# Altium project B101AA.PrjPcb (part 1 of 2)
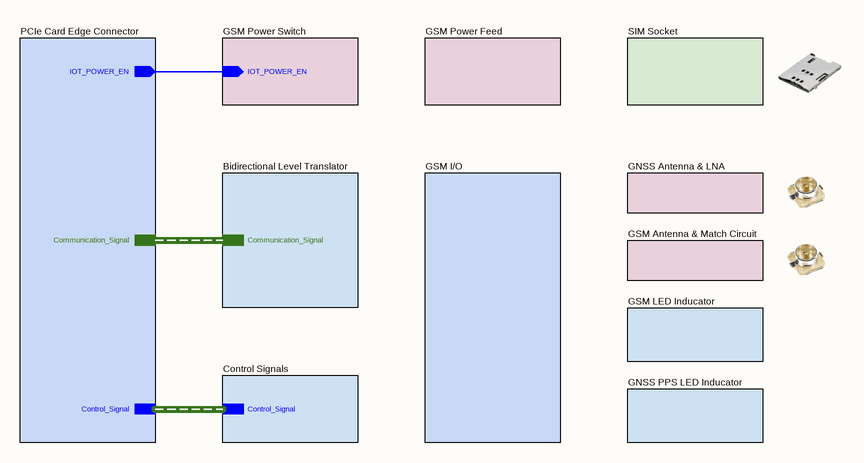
[diagram p0: GSM IoT Block Diagram.SchDoc]
Address1_: Buyuk Kayacik Mah. 4. OSB; Address2_: 103. Cad. No : 12; Address3_: Selcuklu / Konya; Address4_: Türkiye; Copyright_: Copyright 2022 STF Tarim (Commercial Secret); Customer_: STF Irrigation; Engineer_: Gunce Akkoyun; Git_Repo_Address_: www.github.com/akkoyun/B152AA; Module_ID_: B101AA; Organization_: STF Res-Dev; Product_Desc_: --; Product_ID_: --; Revision_: 00.00.01; Version_: R1
15 sheets, 93 parts. Net scope: hierarchical (ports join the sheet entries above them; power ports are global).
Board file: B101AA.PcbDoc
Sheets:
  GSM IoT Block Diagram.SchDoc
    Bidirectional Level Translator = Voltage Translator.SchDoc
    GSM Antenna & Match Circuit = GSM Antenna.SchDoc
    GSM LED Inducator = GSM Stat LED Driver.SchDoc
    SIM Socket = SIM Socket.SchDoc
    GNSS Antenna & LNA = GNSS Antenna.SchDoc
    GSM Power Switch = GSM Power Switch.SchDoc
    GSM I/O = GSM Un Used.SchDoc
    PCIe Card Edge Connector = Card Edge Connector.SchDoc
    GNSS PPS LED Inducator = GNSS PPS LED Driver.SchDoc
    GSM Power Feed = GSM Modem Power Feed.SchDoc
    Control Signals = Signal Control Block.SchDoc
      On-Off Control = On-Off Signal Control.SchDoc
      SDown Control = Shut Down Signal Control.SchDoc
      GNSS Enable Control = GNSS EN Signal Control.SchDoc

## Sheet GSM IoT Block Diagram.SchDoc: GSM IoT Block Diagram
size 292 x 193 mm; SheetNumber: 1; SheetTotal: 14

### Sub-sheets
Bidirectional Level Translator = Voltage Translator.SchDoc: Communication_Signal (harness Communication_Signal)
Control Signals = Signal Control Block.SchDoc: Control_Signal (harness Control_Signal)
GNSS Antenna & LNA = GNSS Antenna.SchDoc: no entries
GNSS PPS LED Inducator = GNSS PPS LED Driver.SchDoc: no entries
GSM Antenna & Match Circuit = GSM Antenna.SchDoc: no entries
GSM I/O = GSM Un Used.SchDoc: no entries
GSM LED Inducator = GSM Stat LED Driver.SchDoc: no entries
GSM Power Feed = GSM Modem Power Feed.SchDoc: no entries
GSM Power Switch = GSM Power Switch.SchDoc: IOT_POWER_EN (in)
PCIe Card Edge Connector = Card Edge Connector.SchDoc: IOT_POWER_EN (out), Control_Signal (harness Control_Signal), Communication_Signal (harness Communication_Signal)
SIM Socket = SIM Socket.SchDoc: no entries

### Nets
IOT_POWER_EN: sheet GSM Power Switch/IOT_POWER_EN, sheet PCIe Card Edge Connector/IOT_POWER_EN

### Buses and harness runs
harness sheet Bidirectional Level Translator/Communication_Signal = sheet PCIe Card Edge Connector/Communication_Signal
harness sheet Control Signals/Control_Signal = sheet PCIe Card Edge Connector/Control_Signal

### Notes on the sheet
- © 2021 All rights reserved.
  This document may not, in whole or in part, be copied, photocopied, reproduced, translated or converted to any electronic or machine readable from without prior written permission of Mehmet Günce Akkoyun.
  Engineer contact : akkoyun@me.com
- Property of
- Engineer :
- Date :
- Size :
- A4
- Time :
- Project :
- Page :
- /
- Customer :
- Product ID :
- Module ID :
- Version :
- File :
- Revision :

## Sheet Voltage Translator.SchDoc: Voltage Translator
size 393 x 292 mm; SheetNumber: 9; SheetTotal: 15
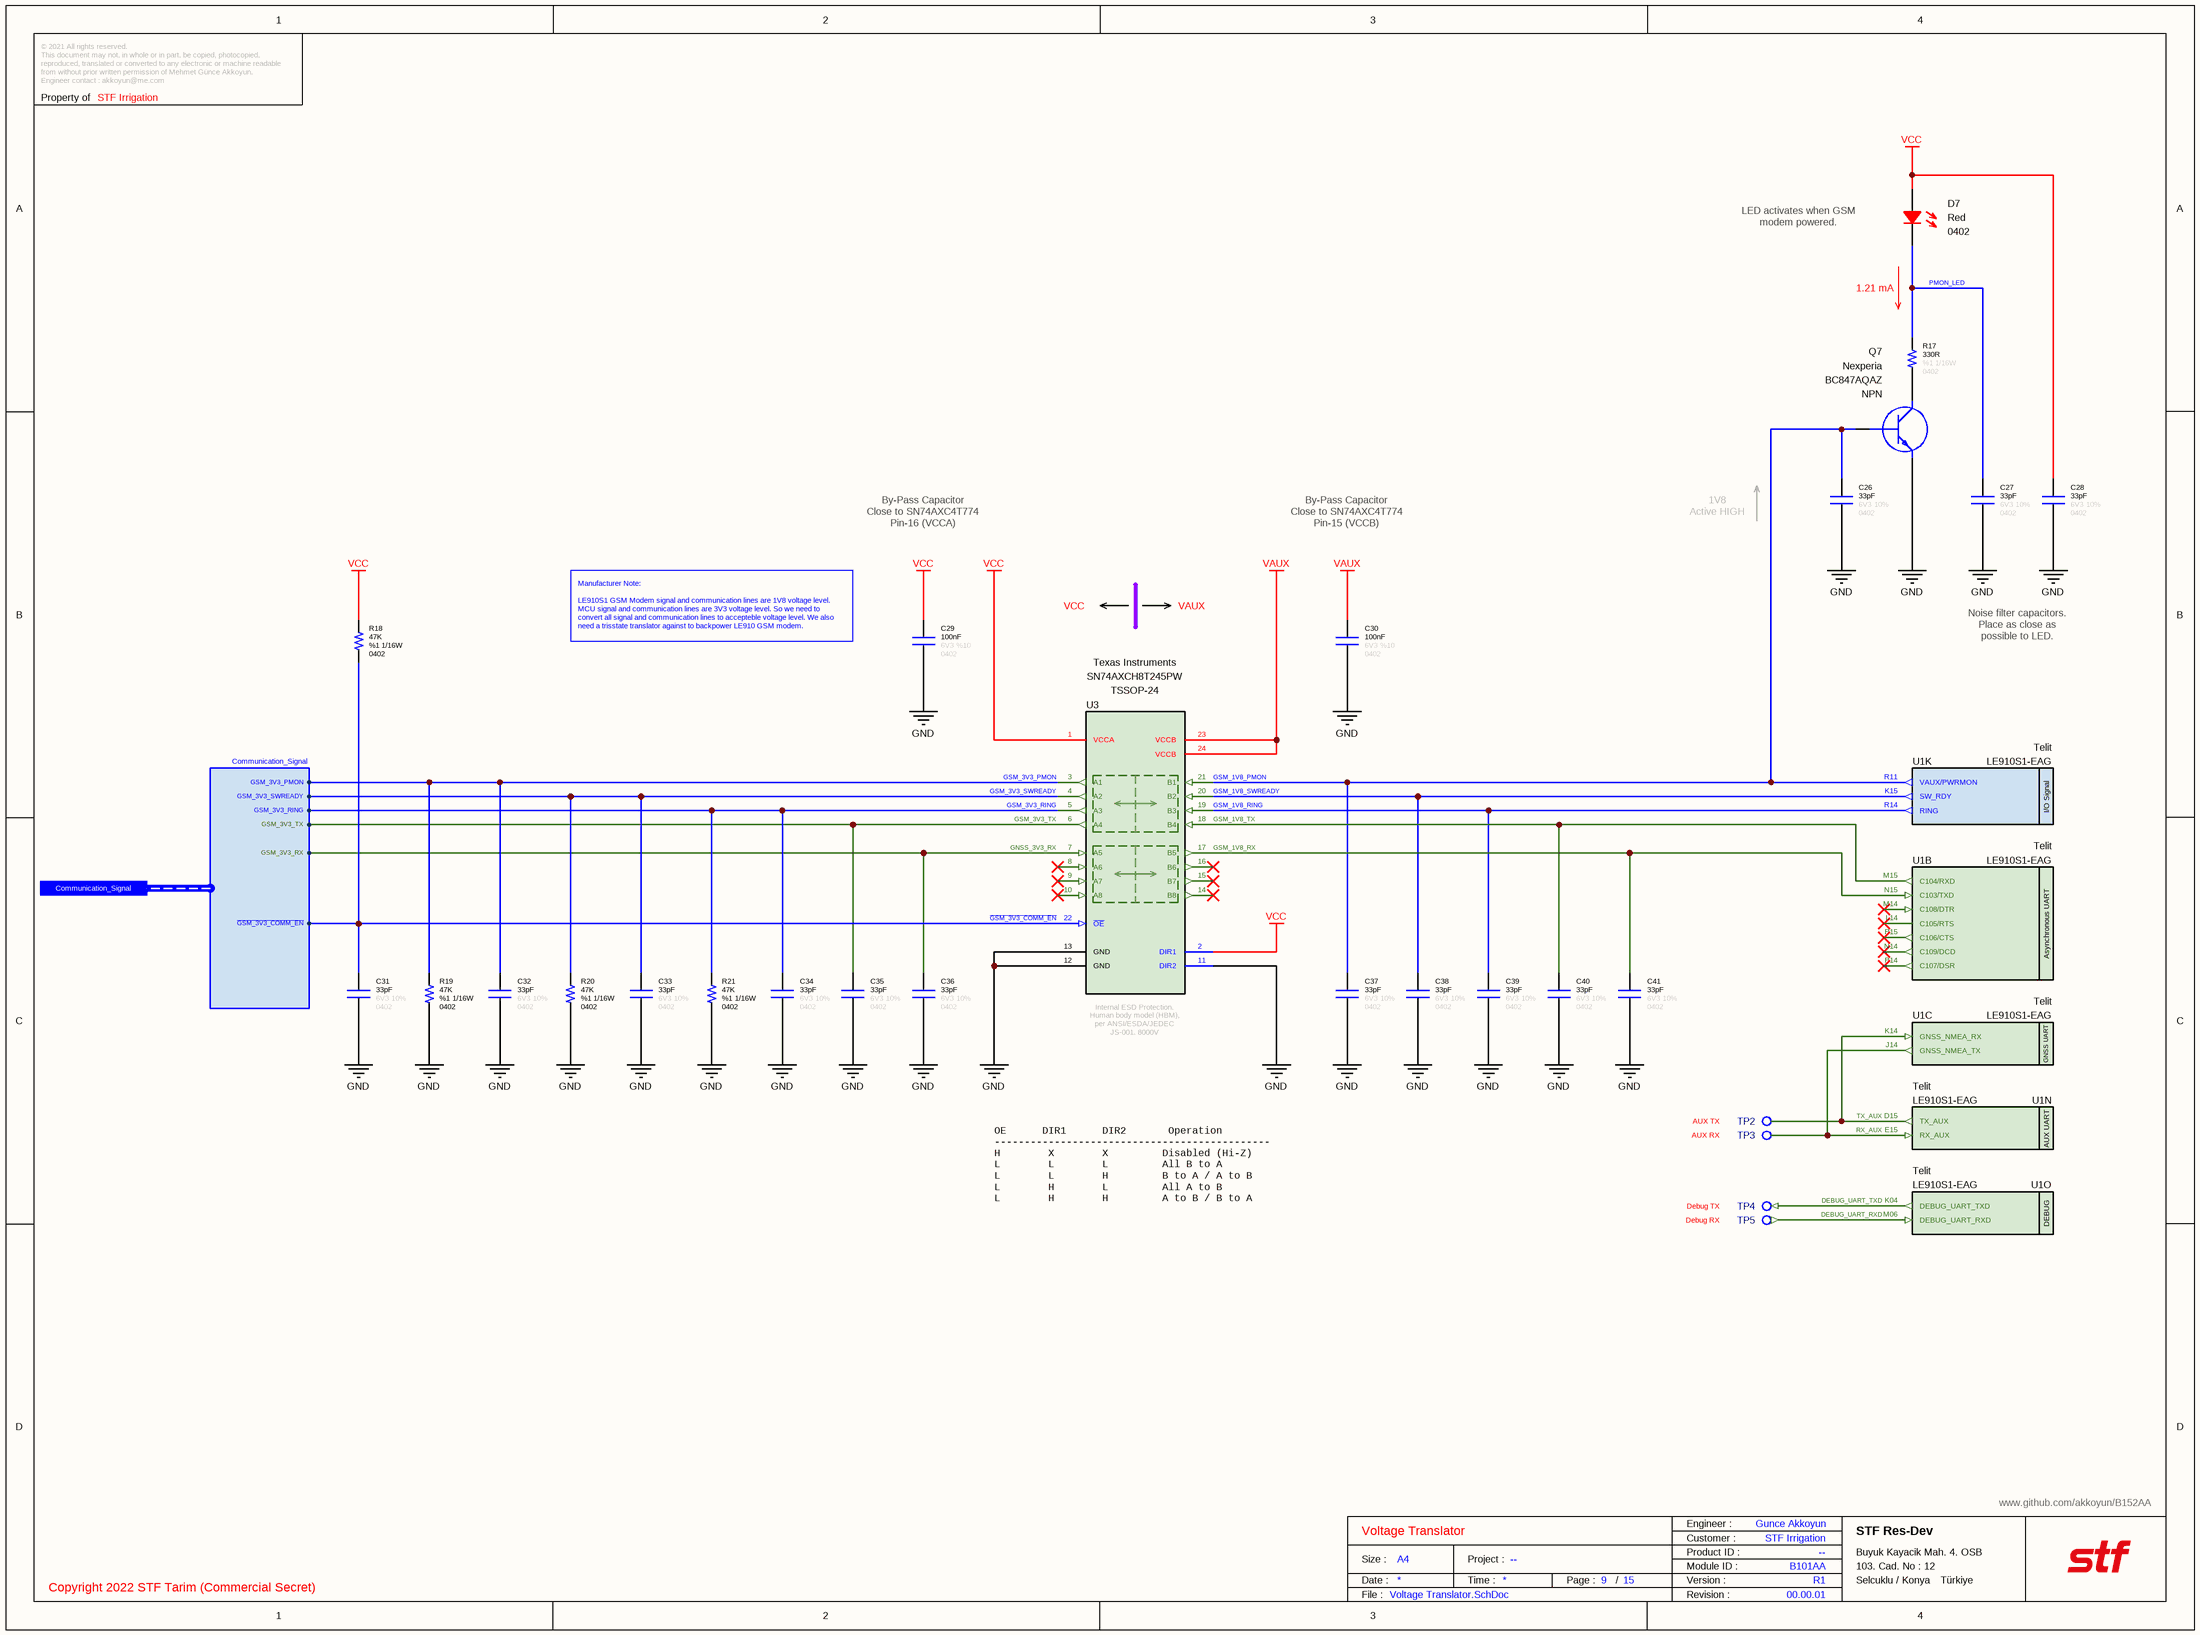
[diagram p1: Voltage Translator.SchDoc]

### Parts
C26  value 33pF  Tolerance: 10%  Case: 0402  Voltage: 6V3  [CAPACITOR_0402]  (hidden comment: Capacitor - 33pF [0402] (Ceramic))
C27  value 33pF  Tolerance: 10%  Case: 0402  Voltage: 6V3  [CAPACITOR_0402]  (hidden comment: Capacitor - 33pF [0402] (Ceramic))
C28  value 33pF  Tolerance: 10%  Case: 0402  Voltage: 6V3  [CAPACITOR_0402]  (hidden comment: Capacitor - 33pF [0402] (Ceramic))
C29  value 100nF  Tolerance: %10  Voltage: 6V3  Case: 0402  [CAPACITOR_0402]  (hidden comment: Capacitor - 100nF [0402] (Ceramic))
C30  value 100nF  Tolerance: %10  Voltage: 6V3  Case: 0402  [CAPACITOR_0402]  (hidden comment: Capacitor - 100nF [0402] (Ceramic))
C31  value 33pF  Tolerance: 10%  Case: 0402  Voltage: 6V3  [CAPACITOR_0402]  (hidden comment: Capacitor - 33pF [0402] (Ceramic))
C32  value 33pF  Tolerance: 10%  Case: 0402  Voltage: 6V3  [CAPACITOR_0402]  (hidden comment: Capacitor - 33pF [0402] (Ceramic))
C33  value 33pF  Tolerance: 10%  Case: 0402  Voltage: 6V3  [CAPACITOR_0402]  (hidden comment: Capacitor - 33pF [0402] (Ceramic))
C34  value 33pF  Tolerance: 10%  Case: 0402  Voltage: 6V3  [CAPACITOR_0402]  (hidden comment: Capacitor - 33pF [0402] (Ceramic))
C35  value 33pF  Tolerance: 10%  Case: 0402  Voltage: 6V3  [CAPACITOR_0402]  (hidden comment: Capacitor - 33pF [0402] (Ceramic))
C36  value 33pF  Tolerance: 10%  Case: 0402  Voltage: 6V3  [CAPACITOR_0402]  (hidden comment: Capacitor - 33pF [0402] (Ceramic))
C37  value 33pF  Tolerance: 10%  Case: 0402  Voltage: 6V3  [CAPACITOR_0402]  (hidden comment: Capacitor - 33pF [0402] (Ceramic))
C38  value 33pF  Tolerance: 10%  Case: 0402  Voltage: 6V3  [CAPACITOR_0402]  (hidden comment: Capacitor - 33pF [0402] (Ceramic))
C39  value 33pF  Tolerance: 10%  Case: 0402  Voltage: 6V3  [CAPACITOR_0402]  (hidden comment: Capacitor - 33pF [0402] (Ceramic))
C40  value 33pF  Tolerance: 10%  Case: 0402  Voltage: 6V3  [CAPACITOR_0402]  (hidden comment: Capacitor - 33pF [0402] (Ceramic))
C41  value 33pF  Tolerance: 10%  Case: 0402  Voltage: 6V3  [CAPACITOR_0402]  (hidden comment: Capacitor - 33pF [0402] (Ceramic))
D7  Case: 0402  Color: Red  [LED_0402]  (hidden comment: SMD LED (Red))
Q7  Manufacturer Name: Nexperia  Polarity: NPN  [SOT1215]  (hidden comment: BC847AQAZ)
R17  value 330R  Case: 0402  Tolerance: %1  Power: 1/16W  [RESISTOR_0402]  (hidden comment: 330R - 0402 - %1 - 1/16W)
R18  value 47K  Tolerance: %1  Case: 0402  Power: 1/16W  [RESISTOR_0402]  (hidden comment: 47K - 0402 - %1 - 1/16W)
R19  value 47K  Tolerance: %1  Case: 0402  Power: 1/16W  [RESISTOR_0402]  (hidden comment: 47K - 0402 - %1 - 1/16W)
R20  value 47K  Tolerance: %1  Case: 0402  Power: 1/16W  [RESISTOR_0402]  (hidden comment: 47K - 0402 - %1 - 1/16W)
R21  value 47K  Tolerance: %1  Case: 0402  Power: 1/16W  [RESISTOR_0402]  (hidden comment: 47K - 0402 - %1 - 1/16W)
TP2  Name: AUX TX  [Test_Pad - Hole]  (no BOM)
TP3  Name: AUX RX  [Test_Pad - Hole]  (no BOM)
TP4  Name: Debug TX  [Test_Pad - Hole]  (no BOM)
TP5  Name: Debug RX  [Test_Pad - Hole]  (no BOM)
U1  Manufacturer Part Number: LE910S1-EAG  Manufacturer Name: Telit  [LE910 GSM Modem]  (hidden comment: LE910S1-EAG LTE GSM Module)  (parts B,C,K,N,O of 19)
U3  Manufacturer Name: Texas Instruments  [TSSOP-24]  (hidden comment: SN74AXCH8T245PW)

### Ports
Communication_Signal (harness Communication_Signal)

### Harnesses
Communication_Signal: GSM_3V3_PMON, GSM_3V3_SWREADY, GSM_3V3_RING, ~{GSM_3V3_COMM_EN}, GSM_3V3_TX, GSM_3V3_RX

### Nets
GND: C26.1 C27.1 C28.1 C29.1 C30.1 C31.1 C32.1 C33.1 C34.1 C35.1 C36.1 C37.1 C38.1 C39.1 C40.1 C41.1 Q7.2(E) R19.1 R20.1 R21.1 U3.11(DIR2) U3.12(GND) U3.13(GND)
VAUX: C30.2 U3.23(VCCB) U3.24(VCCB)
VCC: C28.2 C29.2 D7.2 R18.2 U3.1(VCCA) U3.2(DIR1)
DEBUG_UART_RXD: TP5.1 U1.M06(DEBUG_UART_RXD)
DEBUG_UART_TXD: TP4.1 U1.K04(DEBUG_UART_TXD)
~{GSM_3V3_COMM_EN}: C31.2 R18.1 U3.22(~{OE}) ; port Communication_Signal.~{GSM_3V3_COMM_EN}
GNSS_3V3_RX: C36.2 U3.7(A5) ; port Communication_Signal.GSM_3V3_RX
GSM_1V8_PMON: C26.2 C37.2 Q7.1(B) U1.R11(VAUX/PWRMON) U3.21(B1)
GSM_1V8_RING: C39.2 U1.R14(RING) U3.19(B3)
GSM_1V8_RX: C41.2 U1.N15(C103/TXD) U3.17(B5)
GSM_1V8_SWREADY: C38.2 U1.K15(SW_RDY) U3.20(B2)
GSM_1V8_TX: C40.2 U1.M15(C104/RXD) U3.18(B4)
GSM_3V3_PMON: C32.2 R19.2 U3.3(A1) ; port Communication_Signal.GSM_3V3_PMON
GSM_3V3_RING: C34.2 R21.2 U3.5(A3) ; port Communication_Signal.GSM_3V3_RING
GSM_3V3_SWREADY: C33.2 R20.2 U3.4(A2) ; port Communication_Signal.GSM_3V3_SWREADY
GSM_3V3_TX: C35.2 U3.6(A4) ; port Communication_Signal.GSM_3V3_TX
PMON_LED: C27.2 D7.1 R17.2
RX_AUX: TP3.1 U1.E15(RX_AUX) U1.J14(GNSS_NMEA_TX)
TX_AUX: TP2.1 U1.D15(TX_AUX) U1.K14(GNSS_NMEA_RX)
NetQ7_3: Q7.3(C) R17.1

Not connected (* = marked no-connect by the designer): U1 L14(C105/RTS)* M14(C108/DTR)* N14(C109/DCD)* P14(C107/DSR)* P15(C106/CTS)*; U3 8(A6)* 9(A7)* 10(A8)* 14(B8)* 15(B7)* 16(B6)*

### Notes on the sheet
- (near D7) LED activates when GSM modem powered.
- 1.21 mA
- 1V8
  Active HIGH
- By-Pass Capacitor
  Close to SN74AXC4T774
  Pin-16 (VCCA)
- By-Pass Capacitor
  Close to SN74AXC4T774
  Pin-15 (VCCB)
- Manufacturer Note:
  LE910S1 GSM Modem signal and communication lines are 1V8 voltage level.  MCU signal and communication lines are 3V3 voltage level. So we need to convert all signal and communication lines to accepteble voltage level. We also need a trisstate translator against to backpower LE910 GSM modem.
- VCC
- VAUX
- Noise filter capacitors. Place as close as possible to LED.
- OE      DIR1      DIR2       Operation
  ----------------------------------------------
  H        X        X         Disabled (Hi-Z)
  L        L        L         All B to A
  L        L        H         B to A / A to B
  L        H        L         All A to B
  L        H        H         A to B / B to A
- © 2021 All rights reserved.
  This document may not, in whole or in part, be copied, photocopied, reproduced, translated or converted to any electronic or machine readable from without prior written permission of Mehmet Günce Akkoyun.
  Engineer contact : akkoyun@me.com
- Property of
- Engineer :
- Date :
- Size :
- A4
- Time :
- Project :
- Page :
- /
- Customer :
- Product ID :
- Module ID :
- Version :
- File :
- Revision :
- (in symbol IC - LE910S1-EAG, part B) Asynchronous UART
- (in symbol IC - LE910S1-EAG, part C) GNSS UART
- (in symbol IC - LE910S1-EAG, part K) I/O Signal
- (in symbol IC - LE910S1-EAG, part N) AUX UART
- (in symbol IC - LE910S1-EAG, part O) DEBUG
- (in symbol IC - SN74AXCH8T245PW) Internal ESD Protection. / Human body model (HBM), per ANSI/ESDA/JEDEC JS-001. 8000V

### Library data of the parts
C26-C28 C31-C41 = Capacitor - 33pF [0402-6V3]: Manufacturer Name: Kemet; Manufacturer Part Number: C0402C330J9RACAUTO; ComponentLink1Description: DataSheet; ComponentLink1URL: https://api.kemet.com/component-edge/download/datasheet/C0402C330J9RACAUTO.pdf; ComponentLink2Description: Mouser; ComponentLink2URL: https://www.mouser.com/Search/Refine.aspx?Keyword=80-C0402C330J9RAUTO
C29 C30 = Capacitor - 100nF [0402-6V3]: Capacitor - 100nF [0402-6V3] (Ceramic); Manufacturer Name: AVX; Manufacturer Part Number: 04026D104KAT4A; ComponentLink1Description: Mouser; ComponentLink1URL: https://www.mouser.com.tr/ProductDetail/AVX/04026D104KAT4A?qs=sGAEpiMZZMs0AnBnWHyRQPg4iYkCw7IMED%2F4kpqgf7w%3D; ComponentLink2Description: DataSheet; ComponentLink2URL: https://www.mouser.com.tr/datasheet/2/40/cx5r-776519.pdf
D7 = Diode - LED (0402-Red): Standard LEDs - SMD MINI-MOLD ULTRA COMPACT RED; Manufacturer Name: ROHM Semiconductor; Manufacturer Part Number: SML-P12VTT86R; ROHS: Yes; ComponentLink1Description: DataSheet; ComponentLink1URL: https://www.mouser.com.tr/datasheet/2/348/sml-p1-e-1139198.pdf; ComponentLink2Description: Mouser; ComponentLink2URL: https://www.mouser.com.tr/ProductDetail/ROHM-Semiconductor/SML-P12U2TT86R?qs=sGAEpiMZZMseGfSY3csMkRIBDsfU3UCXJTULB5gem9Ta%252Bp%252BvZ709fg%3D%3D
Q7 = Transistor - BC847: Bipolar NPN Transistors; Case: DFN-1010D-3; Manufacturer Part Number: BC847AQAZ
R17 = Resistor - 330R [0402]: Thick Film Resistors - SMD 1/16 W 330 Ohm 1%; Manufacturer Name: Vishay; Manufacturer Part Number: CRCW0402330RFKED; ComponentLink1Description: DataSheet; ComponentLink1URL: https://www.mouser.com.tr/datasheet/2/427/dcrcwe3-1762152.pdf; ComponentLink2Description: Mouser; ComponentLink2URL: https://www.mouser.com.tr/ProductDetail/Vishay-Dale/CRCW0402330RFKED?qs=sGAEpiMZZMu61qfTUdNhG2DpbjADlD3GGS6SwBlLi5Q%3D
R18-R21 = Resistor - 47K [0402]: Thick Film Resistors - SMD 1/16 W 47 KOhm 1%; Manufacturer Name: Vishay; Manufacturer Part Number: CRCW040247K0FKED; ComponentLink1Description: DataSheet; ComponentLink1URL: https://www.mouser.com.tr/datasheet/2/427/dcrcwe3-1762152.pdf; ComponentLink2Description: Mouser; ComponentLink2URL: https://www.mouser.com.tr/ProductDetail/Vishay-Dale/CRCW040247K0FKED?qs=sGAEpiMZZMu61qfTUdNhG2DpbjADlD3GL%252B3h1elTxqU%3D
TP2-TP5 = Test Point
U1 = IC - LE910S1-EAG: Telit LE910S1-EAG GPRS/GNSS Module; Case: BGA
U3 = IC - SN74AXCH8T245PW: Translation - Voltage Levels 8-Bit Dual-Supply Bus Transceiver 24-TSSOP -40 to 125; Number of Channels: 8 Channel; Logic Family: AXC; Data Rate: 380Mbps; Channel Type: Bidirectional; Supply Voltage - Min: 0V65; Supply Voltage - Max: 3V6; Output Type: Tri-State, Non-Inverted; Operating Supply Current: 60 uA; Propagation Delay Time: 4 ns; ROHS: Yes; Minimum Operating Temperature: - 40 C; Product Type: Translation - Voltage Levels; Maximum Operating Temperature: + 125 C; Manufacturer Part Number: SN74AXCH8T245PW; Case: TSSOP-24

## Sheet GSM Antenna.SchDoc: GSM Antenna & Match Circuit
size 292 x 193 mm; SheetNumber: 13; SheetTotal: 15
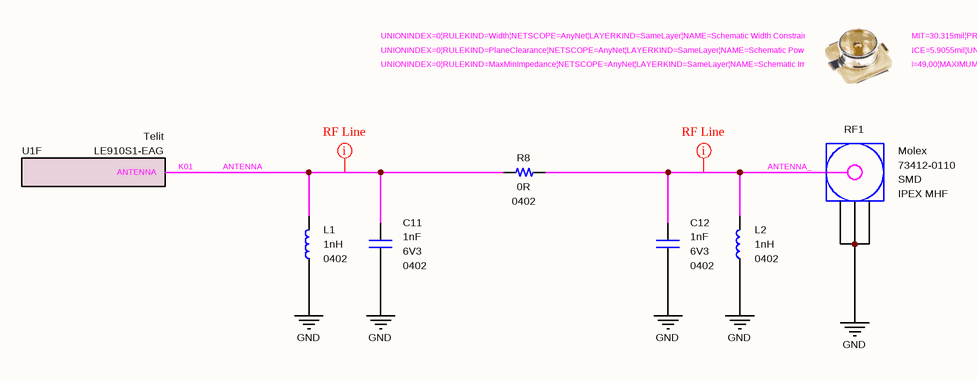
[diagram p2: GSM Antenna.SchDoc]

### Parts
C11  value 1nF  Case: 0402  Voltage: 6V3  [CAPACITOR_0402]
C12  value 1nF  Case: 0402  Voltage: 6V3  [CAPACITOR_0402]
L1  value 1nH  Case: 0402  [INDUCTOR_0402]
L2  value 1nH  Case: 0402  [INDUCTOR_0402]
R8  value 0R  Case: 0402  [RESISTOR_0402]
RF1  Connector Type: IPEX MHF  Case: SMD  Manufacturer Part Number: 73412-0110  Manufacturer Name: Molex  [Connector_IPEX]
U1  Manufacturer Part Number: LE910S1-EAG  Manufacturer Name: Telit  [LE910 GSM Modem]  (hidden comment: LE910S1-EAG LTE GSM Module)  (part F of 19)

### Nets
GND: C11.1 C12.1 L1.1 L2.1 RF1.2(GND) RF1.3(GND) RF1.4(GND)
ANTENNA: C11.2 L1.2 R8.2 U1.K01(ANTENNA)
ANTENNA_: C12.2 L2.2 R8.1 RF1.1(Signal)

### Layout directives
rule Impedance Constraint [Min = 49.00    Max = 50.00    ]; rule Power Plane Clearance [Clearance = 5.906mil]; rule Width Constraint [Pref Width = 0.77mm    Min Width = 0.77mm    Max Width = 0.77mm]: ANTENNA, ANTENNA_

### Notes on the sheet
- © 2021 All rights reserved.
  This document may not, in whole or in part, be copied, photocopied, reproduced, translated or converted to any electronic or machine readable from without prior written permission of Mehmet Günce Akkoyun.
  Engineer contact : akkoyun@me.com
- Property of
- Engineer :
- Date :
- Size :
- A4
- Time :
- Project :
- Page :
- /
- Customer :
- Product ID :
- Module ID :
- Version :
- File :
- Revision :

### Library data of the parts
C11 C12 = 1nF [0402-6V3]: Capacitor - 1nF [0402] (Ceramic); Manufacturer Name: AVX; Manufacturer Part Number: 04026C102MAT2A; Dielectric: X7R; Tolerance: 20%; Maximum Operating Temperature: +125; Minimum Operating Temperature: -55; Height: 0.25mm; ROHS: Yes; Weight: 0.65mg; ComponentLink1Description: DataSheet; ComponentLink1URL: https://www.mouser.com.tr/datasheet/2/40/X7RDielectric-777024.pdf
L1 L2 = 1nH [0402]: Fixed Inductor; Manufacturer Name: Murata Electronics; Manufacturer Part Number: LQG15HN1N0S02D; Tolerance: 0.3 nH; Height: 0.35mm; ComponentLink1Description: DataSheet; ComponentLink1URL: https://www.mouser.com.tr/datasheet/2/281/JELF243B-0009-1699631.pdf
R8 = 0R: Thick Film Resistors - SMD 1/16 W 0 Ohms; Manufacturer Name: Vishay; Manufacturer Part Number: CRCW04020000Z0ED; Height: 0.4mm; ComponentLink1Description: DataSheet; ComponentLink1URL: https://www.mouser.com.tr/datasheet/2/427/dcrcwe3-1762152.pdf; ComponentLink2Description: Mouser; ComponentLink2URL: https://www.mouser.com.tr/ProductDetail/Vishay-Dale/CRCW04020000Z0ED?qs=sGAEpiMZZMu61qfTUdNhG2DpbjADlD3GG34cJb50zyg%3D
RF1 = IPEX MHF Connector: MOLEX   73412-0110   RF COAXIAL, MICROCOAXIAL, JACK, 50OHM; ROHS: Yes; Product Type: RF Connectors; Impedance: 50 Ohm; System: Connector
U1 = IC - LE910S1-EAG: Telit LE910S1-EAG GPRS/GNSS Module; Case: BGA

## Sheet GSM Stat LED Driver.SchDoc: Modem LED Driver
size 292 x 193 mm; SheetNumber: 10; SheetTotal: 15
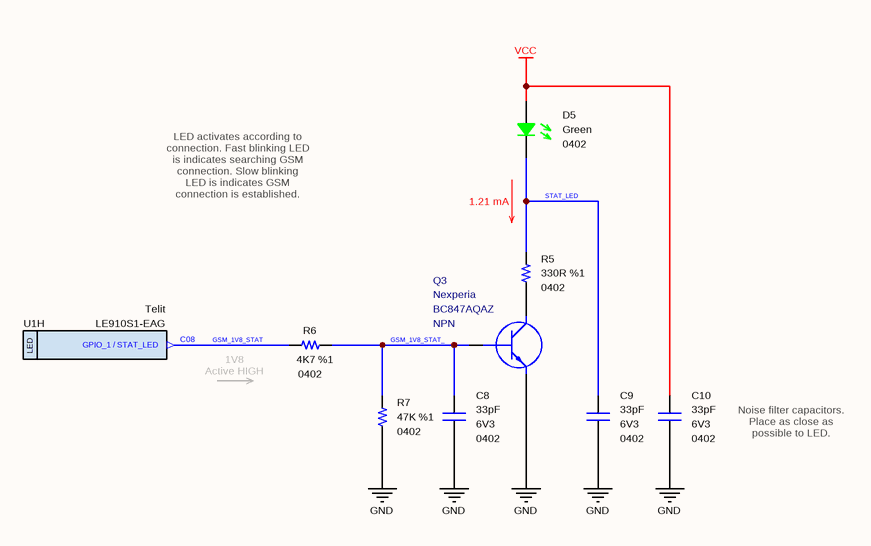
[diagram p3: GSM Stat LED Driver.SchDoc]

### Parts
C8  value 33pF  Case: 0402  Voltage: 6V3  [CAPACITOR_0402]
C9  value 33pF  Case: 0402  Voltage: 6V3  [CAPACITOR_0402]
C10  value 33pF  Case: 0402  Voltage: 6V3  [CAPACITOR_0402]
D5  Case: 0402  Color: Green  [LED_0402]
Q3  Polarity: NPN  Manufacturer Part Number: BC847AQAZ  Manufacturer Name: Nexperia  [SOT1215]
R5  value 330R  Case: 0402  Tolerance: %1  [RESISTOR_0402]
R6  value 4K7  Case: 0402  Tolerance: %1  [RESISTOR_0402]
R7  value 47K  Case: 0402  Tolerance: %1  [RESISTOR_0402]
U1  Manufacturer Part Number: LE910S1-EAG  Manufacturer Name: Telit  [LE910 GSM Modem]  (hidden comment: LE910S1-EAG LTE GSM Module)  (part H of 19)

### Nets
GND: C8.1 C9.1 C10.1 Q3.2(E) R7.1
VCC: C10.2 D5.2
GSM_1V8_STAT: R6.2 U1.C08(GPIO_1_/_STAT_LED)
GSM_1V8_STAT_: C8.2 Q3.1(B) R6.1 R7.2
STAT_LED: C9.2 D5.1 R5.2
NetQ3_3: Q3.3(C) R5.1

### Notes on the sheet
- LED activates according to connection. Fast blinking LED is indicates searching GSM connection. Slow blinking LED is indicates GSM connection is established.
- 1.21 mA
- 1V8
  Active HIGH
- Noise filter capacitors. Place as close as possible to LED.
- © 2021 All rights reserved.
  This document may not, in whole or in part, be copied, photocopied, reproduced, translated or converted to any electronic or machine readable from without prior written permission of Mehmet Günce Akkoyun.
  Engineer contact : akkoyun@me.com
- Property of
- Engineer :
- Date :
- Size :
- A4
- Time :
- Project :
- Page :
- /
- Customer :
- Product ID :
- Module ID :
- Version :
- File :
- Revision :
- (in symbol IC - LE910S1-EAG, part H) LED

### Library data of the parts
C8-C10 = 33pF [0402-6V3]: Capacitor - 33pF [0402] (Ceramic); Manufacturer Part Number: C0402C330J9RACAUTO; Manufacturer Name: Kemet; Dielectric: X7R; Tolerance: 10%; Height: 0.5mm; Maximum Operating Temperature: +125; Minimum Operating Temperature: -55; ROHS: Yes; ComponentLink1Description: DataSheet; ComponentLink1URL: https://api.kemet.com/component-edge/download/datasheet/C0402C330J9RACAUTO.pdf; ComponentLink2Description: Mouser; ComponentLink2URL: https://www.mouser.com/Search/Refine.aspx?Keyword=80-C0402C330J9RAUTO
D5 = LED (0402-Green): Standard LEDs - SMD MINI-MOLD ULTRA COMPACT GREEN; Manufacturer Name: ROHM Semiconductor; Manufacturer Part Number: SML-P12MTT86R; ROHS: Yes; ComponentLink1Description: DataSheet; ComponentLink1URL: https://www.mouser.com.tr/datasheet/2/348/sml-p1-e-1139198.pdf; ComponentLink2Description: Mouser; ComponentLink2URL: https://www.mouser.com.tr/ProductDetail/ROHM-Semiconductor/SML-P12U2TT86R?qs=sGAEpiMZZMseGfSY3csMkRIBDsfU3UCXJTULB5gem9Ta%252Bp%252BvZ709fg%3D%3D
Q3 = BC847: Bipolar NPN Transistors; Case: DFN-1010D-3
R5 = 330R: Thick Film Resistors - SMD 1/16 W 330 Ohm 1%; Manufacturer Name: Vishay; Manufacturer Part Number: CRCW0402330RFKED; Height: 0.4mm; ComponentLink1Description: DataSheet; ComponentLink1URL: https://www.mouser.com.tr/datasheet/2/427/dcrcwe3-1762152.pdf; ComponentLink2Description: Mouser; ComponentLink2URL: https://www.mouser.com.tr/ProductDetail/Vishay-Dale/CRCW0402330RFKED?qs=sGAEpiMZZMu61qfTUdNhG2DpbjADlD3GGS6SwBlLi5Q%3D
R6 = 4K7: Thick Film Resistors - SMD 1/16 W 4.7 Kohms 1%; Manufacturer Name: Vishay; Manufacturer Part Number: CRCW04024K70FKED; Height: 0.4mm; ComponentLink1Description: DataSheet; ComponentLink1URL: https://www.mouser.com.tr/datasheet/2/427/dcrcwe3-1762152.pdf; ComponentLink2Description: Mouser; ComponentLink2URL: https://www.mouser.com.tr/ProductDetail/Vishay-Dale/CRCW04024K70FKED?qs=sGAEpiMZZMu61qfTUdNhG7nHf%2F6MTUn3HadIdDQu24Q%3D
R7 = 47K: Thick Film Resistors - SMD 1/16 W 47 Kohms 1%; Manufacturer Name: Vishay; Manufacturer Part Number: CRCW040247K0FKED; ComponentLink1URL: https://www.mouser.com.tr/datasheet/2/427/dcrcwe3-1762152.pdf; ComponentLink1Description: DataSheet; Height: 0.4mm; ComponentLink2Description: Mouser; ComponentLink2URL: https://www.mouser.com.tr/ProductDetail/Vishay-Dale/CRCW040247K0FKED?qs=sGAEpiMZZMu61qfTUdNhG2DpbjADlD3GL%252B3h1elTxqU%3D
U1 = IC - LE910S1-EAG: Telit LE910S1-EAG GPRS/GNSS Module; Case: BGA

## Sheet SIM Socket.SchDoc: SIM Tray
size 292 x 193 mm; SheetNumber: 12; SheetTotal: 15
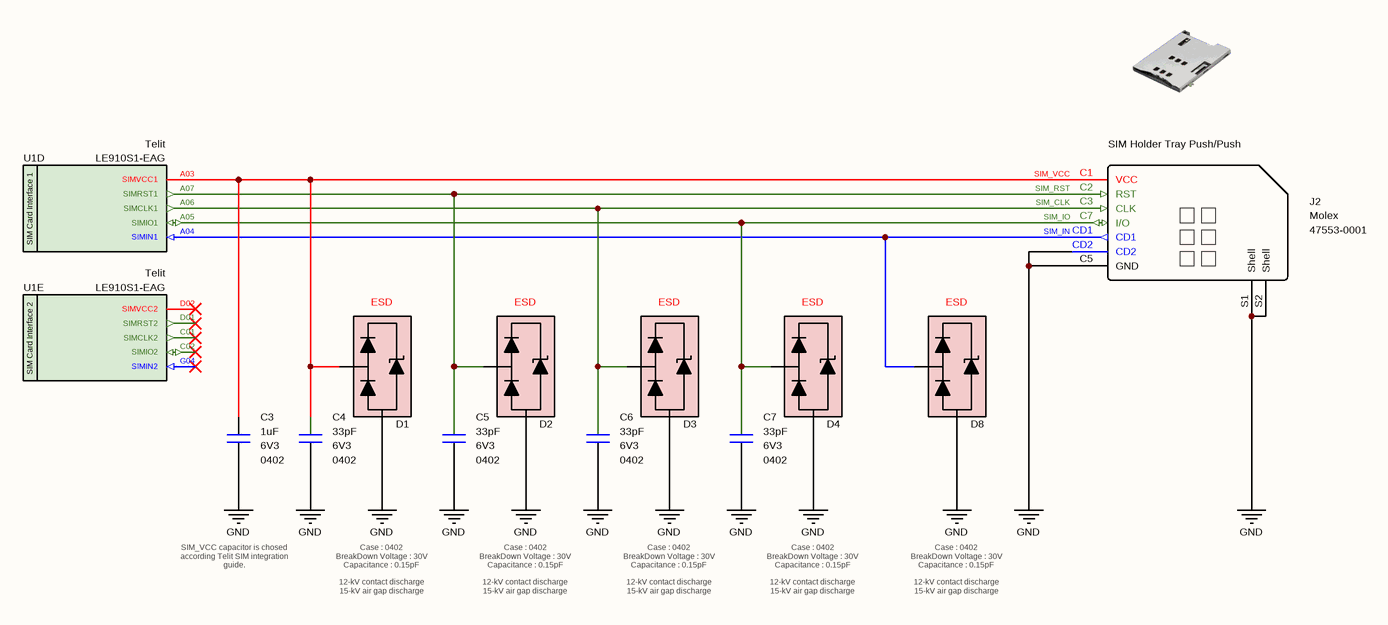
[diagram p4: SIM Socket.SchDoc]

### Parts
C3  value 1uF  Case: 0402  Voltage: 6V3  [Capacitor 0402]
C4  value 33pF  Case: 0402  Voltage: 6V3  [CAPACITOR_0402]
C5  value 33pF  Case: 0402  Voltage: 6V3  [CAPACITOR_0402]
C6  value 33pF  Case: 0402  Voltage: 6V3  [CAPACITOR_0402]
C7  value 33pF  Case: 0402  Voltage: 6V3  [CAPACITOR_0402]
D1  0402ESDA-MLP1  [ESD_0402]  (value not drawn)
D2  0402ESDA-MLP1  [ESD_0402]  (value not drawn)
D3  0402ESDA-MLP1  [ESD_0402]  (value not drawn)
D4  0402ESDA-MLP1  [ESD_0402]  (value not drawn)
D8  0402ESDA-MLP1  [ESD_0402]  (value not drawn)
J2  Card Type: SIM Holder Tray Push/Push  Manufacturer Name: Molex  Manufacturer Part Number: 47553-0001  [Connector - SIM Tray]
U1  Manufacturer Part Number: LE910S1-EAG  Manufacturer Name: Telit  [LE910 GSM Modem]  (hidden comment: LE910S1-EAG LTE GSM Module)  (parts D,E of 19)

### Nets
GND: C3.1 C4.1 C5.1 C6.1 C7.1 D1.2(GND) D2.2(GND) D3.2(GND) D4.2(GND) D8.2(GND) J2.C5(GND) J2.CD2 J2.S1(Shell) J2.S2(Shell)
SIM_CLK: C6.2 D3.1(I/O) J2.C3(CLK) U1.A06(SIMCLK1)
SIM_IN: D8.1(I/O) J2.CD1 U1.A04(SIMIN1)
SIM_IO: C7.2 D4.1(I/O) J2.C7(I/O) U1.A05(SIMIO1)
SIM_RST: C5.2 D2.1(I/O) J2.C2(RST) U1.A07(SIMRST1)
SIM_VCC: C3.2 C4.2 D1.1(I/O) J2.C1(VCC) U1.A03(SIMVCC1)

Not connected (* = marked no-connect by the designer): U1 C01(SIMCLK2)* C02(SIMIO2)* D01(SIMRST2)* D02(SIMVCC2)* G04(SIMIN2)*

### Notes on the sheet
- SIM_VCC capacitor is chosed according Telit SIM integration guide.
- Case : 0402
  BreakDown Voltage : 30V
  Capacitance : 0.15pF
  12-kV contact discharge
  15-kV air gap discharge
- © 2021 All rights reserved.
  This document may not, in whole or in part, be copied, photocopied, reproduced, translated or converted to any electronic or machine readable from without prior written permission of Mehmet Günce Akkoyun.
  Engineer contact : akkoyun@me.com
- Property of
- Engineer :
- Date :
- Size :
- A4
- Time :
- Project :
- Page :
- /
- Customer :
- Product ID :
- Module ID :
- Version :
- File :
- Revision :
- (in symbol Diode - TPD1E05U06DPYR) ESD
- (in symbol IC - LE910S1-EAG, part D) SIM Card Interface 1
- (in symbol IC - LE910S1-EAG, part E) SIM Card Interface 2

### Library data of the parts
C3 = 1uF [0402-6V3]: Multilayer Ceramic Capacitors - SMD - 6.3V 1uF X5R 0402 20%; Manufacturer Part Number: GRM153R60J105ME95D; Manufacturer Name: Murata; Dielectric: X5R; Product Type: Multilayer Ceramic Capacitors; Tolerance: 20%; Minimum Operating Temperature: - 55 C; Width: 0.5mm; Maximum Operating Temperature: + 85 C; Length: 1mm; Height: 0.3mm
C4-C7 = 33pF [0402-6V3]: as C8 on sheet GSM Stat LED Driver; Height: 0.5mm; Maximum Operating Temperature: +125; Minimum Operating Temperature: -55; ROHS: Yes; ComponentLink1Description: DataSheet; ComponentLink1URL: https://api.kemet.com/component-edge/download/datasheet/C0402C330J9RACAUTO.pdf; ComponentLink2Description: Mouser; ComponentLink2URL: https://www.mouser.com/Search/Refine.aspx?Keyword=80-C0402C330J9RAUTO
D1-D4 D8 = Diode - TPD1E05U06DPYR: SUPPRESSOR ESD 30VDC 0402 HFREE; Manufacturer Name: Eaton; Breakdown Voltage: 30V; Capacitance: 0.15pF; Manufacturer Part Number: 0402ESDA-MLP1; Case: 0402
J2 = Sim Holder: Memory Card Connectors ASSY 1.90 SIM CARD R IM CARD READER CONN.
U1 = IC - LE910S1-EAG: Telit LE910S1-EAG GPRS/GNSS Module; Case: BGA

## Sheet GNSS Antenna.SchDoc: GNSS Antenna & LNA
size 292 x 193 mm; SheetNumber: 14; SheetTotal: 15
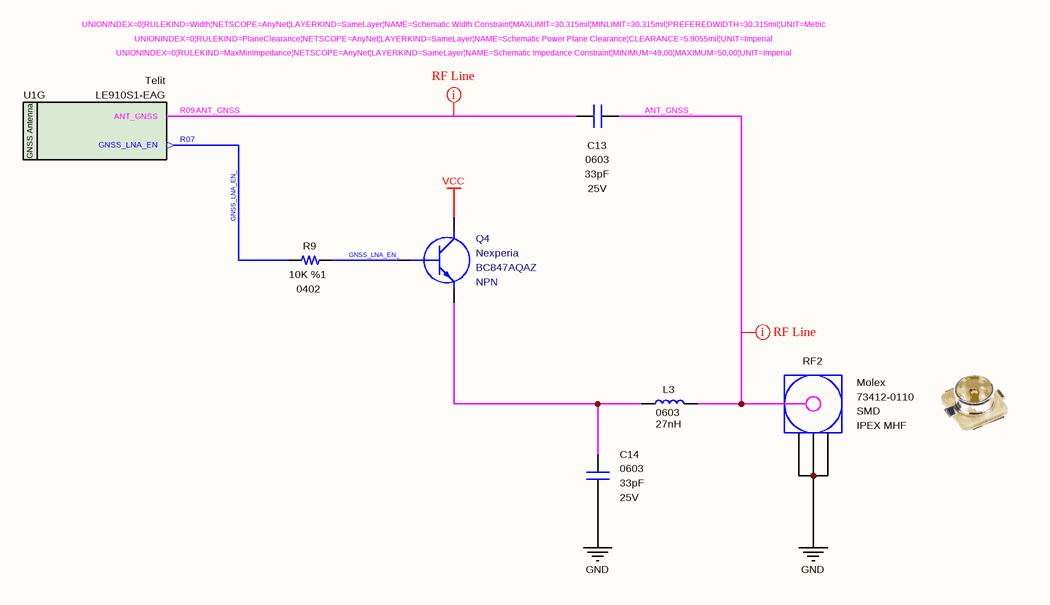
[diagram p5: GNSS Antenna.SchDoc]

### Parts
C13  value 33pF  Case: 0603  Voltage: 25V  [CAPACITOR_0603]
C14  value 33pF  Case: 0603  Voltage: 25V  [CAPACITOR_0603]
L3  value 27nH  Case: 0603  [INDUCTOR_0603]
Q4  Manufacturer Name: Nexperia  Manufacturer Part Number: BC847AQAZ  Polarity: NPN  [SOT1215]
R9  value 10K  Case: 0402  Tolerance: %1  [RESISTOR_0402]
RF2  Connector Type: IPEX MHF  Case: SMD  Manufacturer Part Number: 73412-0110  Manufacturer Name: Molex  [Connector_IPEX]
U1  Manufacturer Part Number: LE910S1-EAG  Manufacturer Name: Telit  [LE910 GSM Modem]  (hidden comment: LE910S1-EAG LTE GSM Module)  (part G of 19)

### Nets
GND: C14.1 RF2.2(GND) RF2.3(GND) RF2.4(GND)
VCC: Q4.3(C)
ANT_GNSS: C13.2 U1.R09(ANT_GNSS)
ANT_GNSS_: C13.1 L3.2 RF2.1(Signal)
GNSS_LNA_EN_: Q4.1(B) R9.1 R9.2 U1.R07(GNSS_LNA_EN)
NetC14_2: C14.2 L3.1 Q4.2(E)

### Layout directives
rule Impedance Constraint [Min = 49.00    Max = 50.00    ]; rule Power Plane Clearance [Clearance = 5.906mil]; rule Width Constraint [Pref Width = 0.77mm    Min Width = 0.77mm    Max Width = 0.77mm]: ANT_GNSS, ANT_GNSS_

### Notes on the sheet
- © 2021 All rights reserved.
  This document may not, in whole or in part, be copied, photocopied, reproduced, translated or converted to any electronic or machine readable from without prior written permission of Mehmet Günce Akkoyun.
  Engineer contact : akkoyun@me.com
- Property of
- Engineer :
- Date :
- Size :
- A4
- Time :
- Project :
- Page :
- /
- Customer :
- Product ID :
- Module ID :
- Version :
- File :
- Revision :
- (in symbol IC - LE910S1-EAG, part G) GNSS Antenna

### Library data of the parts
C13 C14 = 33pF [0603-25V]: Capacitor - 33pF [0603] (Ceramic); Manufacturer Name: Kyocera AVX; Manufacturer Part Number: 06033A330F4T2A; Dielectric: C0G; Tolerance: 1%; Height: 0.9mm; Maximum Operating Temperature: +125; Minimum Operating Temperature: -55; ROHS: Yes; ComponentLink1Description: DataSheet; ComponentLink1URL: https://api.kemet.com/component-edge/download/datasheet/C0402C330J9RACAUTO.pdf; ComponentLink2Description: Mouser; ComponentLink2URL: https://www.mouser.com/Search/Refine.aspx?Keyword=80-C0402C330J9RAUTO
L3 = 27nH [0603]: Fixed Inductor; Manufacturer Name: Murata Electronics; Manufacturer Part Number: LQW18AN27NJ00D; Tolerance: 5%; Height: 0.8mm; ComponentLink1Description: DataSheet; ComponentLink1URL: https://www.mouser.com.tr/datasheet/2/281/JELF243B-0009-1699631.pdf
Q4 = BC847: Bipolar NPN Transistors; Case: DFN-1010D-3
R9 = 10K: Thick Film Resistors - SMD 1/16 W 10 Kohms 1%; Manufacturer Name: Vishay; Manufacturer Part Number: CRCW040210K0FKED; Height: 0.4mm; ComponentLink1Description: DataSheet; ComponentLink1URL: https://www.mouser.com.tr/datasheet/2/427/dcrcwe3-1762152.pdf; ComponentLink2Description: Mouser; ComponentLink2URL: https://www.mouser.com.tr/ProductDetail/Vishay-Dale/CRCW040210K0FKED?qs=sGAEpiMZZMu61qfTUdNhG2DpbjADlD3GcalbOv9utCY%3D
RF2 = IPEX MHF Connector: as RF1 on sheet GSM Antenna; ROHS: Yes; Product Type: RF Connectors; Impedance: 50 Ohm; System: Connector
U1 = IC - LE910S1-EAG: Telit LE910S1-EAG GPRS/GNSS Module; Case: BGA

## Sheet GSM Power Switch.SchDoc: GSM Modem Power Feed
size 292 x 193 mm; SheetNumber: 3; SheetTotal: 15
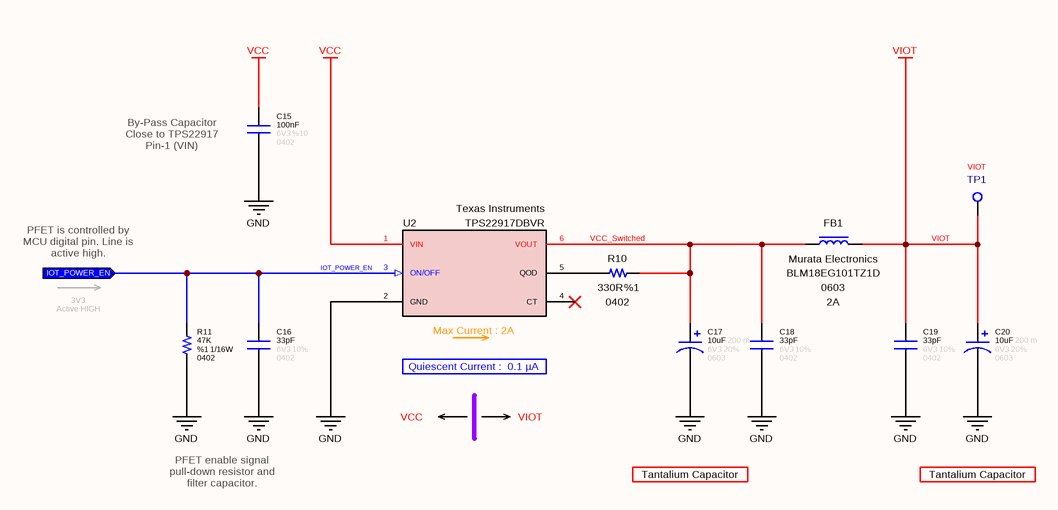
[diagram p6: GSM Power Switch.SchDoc]

### Parts
C15  value 100nF  Tolerance: %10  Voltage: 6V3  Case: 0402  [CAPACITOR_0402]  (hidden comment: Capacitor - 100nF [0402] (Ceramic))
C16  value 33pF  Tolerance: 10%  Case: 0402  Voltage: 6V3  [CAPACITOR_0402]  (hidden comment: Capacitor - 33pF [0402] (Ceramic))
C17  value 10uF  ESR: 200 m  Tolerance: 20%  Case: 0603  Voltage: 6V3  [CAPACITOR_0603_Tantalum]  (hidden comment: Capacitor - 10uF [0603] (Tantalum))
C18  value 33pF  Tolerance: 10%  Case: 0402  Voltage: 6V3  [CAPACITOR_0402]  (hidden comment: Capacitor - 33pF [0402] (Ceramic))
C19  value 33pF  Tolerance: 10%  Case: 0402  Voltage: 6V3  [CAPACITOR_0402]  (hidden comment: Capacitor - 33pF [0402] (Ceramic))
C20  value 10uF  ESR: 200 m  Tolerance: 20%  Case: 0603  Voltage: 6V3  [CAPACITOR_0603_Tantalum]  (hidden comment: Capacitor - 10uF [0603] (Tantalum))
FB1  Case: 0603  Maximum DC Current: 2A  Manufacturer Part Number: BLM18EG101TZ1D  Manufacturer Name: Murata Electronics  [INDUCTOR_0603]
R10  value 330R  Tolerance: %1  Case: 0402  [RESISTOR_0402]
R11  value 47K  Tolerance: %1  Case: 0402  Power: 1/16W  [RESISTOR_0402]  (hidden comment: 47K - 0402 - %1 - 1/16W)
TP1  Name: VIOT  [Test_Point]  (no BOM)
U2  Manufacturer Part Number: TPS22917DBVR  Manufacturer Name: Texas Instruments  [SOT-23-6]  (hidden comment: Power Switch)

### Ports
IOT_POWER_EN (in)

### Nets
GND: C15.1 C16.1 C17.2 C18.1 C19.1 C20.2 R11.1 U2.2(GND)
VCC: C15.2 U2.1(VIN)
VIOT: C19.2 C20.1 FB1.2 TP1.1
IOT_POWER_EN: C16.2 R11.2 U2.3(ON/OFF) ; port IOT_POWER_EN
VCC_Switched: C17.1 C18.2 FB1.1 R10.1 U2.6(VOUT)
NetR10_2: R10.2 U2.5(QOD)

Not connected (* = marked no-connect by the designer): U2 4(CT)*

### Notes on the sheet
- (near C15) By-Pass Capacitor
  Close to TPS22917
  Pin-1 (VIN)
- PFET is controlled by MCU digital pin. Line is active high.
- (near U2) Internal ESD Protection
- 3V3
  Active HIGH
- Quiescent Current :  0.1 µA
- (near U2) Max Current : 2A
- VCC
- VIOT
- PFET enable signal pull-down resistor and filter capacitor.
- Tantalium Capacitor
- © 2021 All rights reserved.
  This document may not, in whole or in part, be copied, photocopied, reproduced, translated or converted to any electronic or machine readable from without prior written permission of Mehmet Günce Akkoyun.
  Engineer contact : akkoyun@me.com
- Property of
- Engineer :
- Date :
- Size :
- A4
- Time :
- Project :
- Page :
- /
- Customer :
- Product ID :
- Module ID :
- Version :
- File :
- Revision :

### Library data of the parts
C15 = Capacitor - 100nF [0402-6V3]: as C29 on sheet Voltage Translator; ComponentLink1Description: Mouser; ComponentLink1URL: https://www.mouser.com.tr/ProductDetail/AVX/04026D104KAT4A?qs=sGAEpiMZZMs0AnBnWHyRQPg4iYkCw7IMED%2F4kpqgf7w%3D; ComponentLink2Description: DataSheet; ComponentLink2URL: https://www.mouser.com.tr/datasheet/2/40/cx5r-776519.pdf
C16 C18 C19 = Capacitor - 33pF [0402-6V3]: as C26 on sheet Voltage Translator; ComponentLink1Description: DataSheet; ComponentLink1URL: https://api.kemet.com/component-edge/download/datasheet/C0402C330J9RACAUTO.pdf; ComponentLink2Description: Mouser; ComponentLink2URL: https://www.mouser.com/Search/Refine.aspx?Keyword=80-C0402C330J9RAUTO
C17 C20 = Capacitor - 10uF [0603-6V3] (Tantalium): Capacitor - 10uF [0603] (Tantalium); Manufacturer Name: AVX; Manufacturer Part Number: F380J106MMAAH3; ComponentLink1Description: DataSheet; ComponentLink1URL: https://www.mouser.com.tr/datasheet/2/40/f38-775706.pdf; ComponentLink2Description: Mouser; ComponentLink2URL: https://www.mouser.com.tr/ProductDetail/AVX/F380J106MMAAH3?qs=sGAEpiMZZMtZ1n0r9vR22fixilZl6Mr8zRKleESmvcDFwZ4LSyC6Pg%3D%3D
FB1 = Ferrite Bead [SMD]: Ferrite Beads 0603 100ohms 2000mA Auto Infotainment; Tolerance: 25%; Maximum DC Resistance: 45 mOhms; Value: BLM18EG101TZ1D; Height: 0.75mm; Minimum Operating Temperature: -55; Maximum Operating Temperature: + 125
R10 = 330R: as R5 on sheet GSM Stat LED Driver; Height: 0.4mm; ComponentLink1Description: DataSheet; ComponentLink1URL: https://www.mouser.com.tr/datasheet/2/427/dcrcwe3-1762152.pdf; ComponentLink2Description: Mouser; ComponentLink2URL: https://www.mouser.com.tr/ProductDetail/Vishay-Dale/CRCW0402330RFKED?qs=sGAEpiMZZMu61qfTUdNhG2DpbjADlD3GGS6SwBlLi5Q%3D
R11 = Resistor - 47K [0402]: as R18 on sheet Voltage Translator; ComponentLink1Description: DataSheet; ComponentLink1URL: https://www.mouser.com.tr/datasheet/2/427/dcrcwe3-1762152.pdf; ComponentLink2Description: Mouser; ComponentLink2URL: https://www.mouser.com.tr/ProductDetail/Vishay-Dale/CRCW040247K0FKED?qs=sGAEpiMZZMu61qfTUdNhG2DpbjADlD3GL%252B3h1elTxqU%3D
TP1 = Test Point
U2 = IC - TPS22917: Power Switch MosFet; Height: 1.45mm; ComponentLink1Description: DataSheet; ComponentLink1URL: http://www.ti.com/lit/gpn/tps22917; ComponentLink2Description: Mouser; ComponentLink2URL: https://www.mouser.com/Search/Refine.aspx?Keyword=595-TPS22917DBVR; Case: SOT-23-6

## Sheet GSM Un Used.SchDoc: LE910 Un Used Pins
size 292 x 193 mm; SheetNumber: 15; SheetTotal: 15
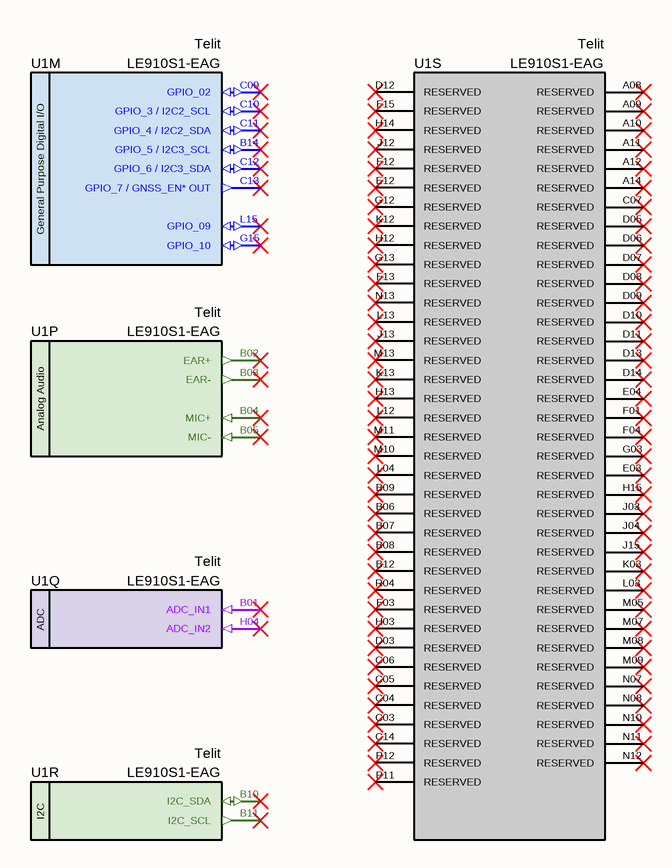
[diagram p7: GSM Un Used.SchDoc]

### Parts
U1  Manufacturer Part Number: LE910S1-EAG  Manufacturer Name: Telit  [LE910 GSM Modem]  (hidden comment: LE910S1-EAG LTE GSM Module)  (parts M,P,Q,R,S of 19)

### Nets

Not connected (* = marked no-connect by the designer): U1 A08(RESERVED)* A09(RESERVED)* A10(RESERVED)* A11(RESERVED)* A12(RESERVED)* A14(RESERVED)* B01(ADC_IN1)* B02(EAR+)* B03(EAR-)* B04(MIC+)* B05(MIC-)* B06(RESERVED)* B07(RESERVED)* B08(RESERVED)* B09(RESERVED)* B10(I2C_SDA)* B11(I2C_SCL)* B12(RESERVED)* B14(GPIO_5_/_I2C3_SCL)* C03(RESERVED)* C04(RESERVED)* C05(RESERVED)* C06(RESERVED)* C07(RESERVED)* C09(GPIO_02)* C10(GPIO_3_/_I2C2_SCL)* C11(GPIO_4_/_I2C2_SDA)* C12(GPIO_6_/_I2C3_SDA)* C13(GPIO_7_/_GNSS_EN*_OUT)* C14(RESERVED)* D03(RESERVED)* D05(RESERVED)* D06(RESERVED)* D07(RESERVED)* D08(RESERVED)* D09(RESERVED)* D10(RESERVED)* D11(RESERVED)* D12(RESERVED)* D13(RESERVED)* D14(RESERVED)* E03(RESERVED)* E04(RESERVED)* E12(RESERVED)* F01(RESERVED)* F03(RESERVED)* F04(RESERVED)* F12(RESERVED)* F13(RESERVED)* F15(RESERVED)* G03(RESERVED)* G12(RESERVED)* G13(RESERVED)* G15(GPIO_10)* H03(RESERVED)* H04(ADC_IN2)* H12(RESERVED)* H13(RESERVED)* H14(RESERVED)* H15(RESERVED)* J03(RESERVED)* J04(RESERVED)* J12(RESERVED)* J13(RESERVED)* J15(RESERVED)* K03(RESERVED)* K12(RESERVED)* K13(RESERVED)* L03(RESERVED)* L04(RESERVED)* L12(RESERVED)* L13(RESERVED)* L15(GPIO_09)* M05(RESERVED)* M07(RESERVED)* M08(RESERVED)* M09(RESERVED)* M10(RESERVED)* M11(RESERVED)* M13(RESERVED)* N07(RESERVED)* N08(RESERVED)* N10(RESERVED)* N11(RESERVED)* N12(RESERVED)* N13(RESERVED)* P11(RESERVED)* P12(RESERVED)* R04(RESERVED)*

### Notes on the sheet
- © 2021 All rights reserved.
  This document may not, in whole or in part, be copied, photocopied, reproduced, translated or converted to any electronic or machine readable from without prior written permission of Mehmet Günce Akkoyun.
  Engineer contact : akkoyun@me.com
- Property of
- Engineer :
- Date :
- Size :
- A4
- Time :
- Project :
- Page :
- /
- Customer :
- Product ID :
- Module ID :
- Version :
- File :
- Revision :
- (in symbol IC - LE910S1-EAG, part M) General Purpose Digital I/O
- (in symbol IC - LE910S1-EAG, part P) Analog Audio
- (in symbol IC - LE910S1-EAG, part Q) ADC
- (in symbol IC - LE910S1-EAG, part R) I2C

### Library data of the parts
U1 = IC - LE910S1-EAG: Telit LE910S1-EAG GPRS/GNSS Module; Case: BGA

## Sheet Card Edge Connector.SchDoc: Card Edge Connector
size 292 x 193 mm; SheetNumber: 2; SheetTotal: 14
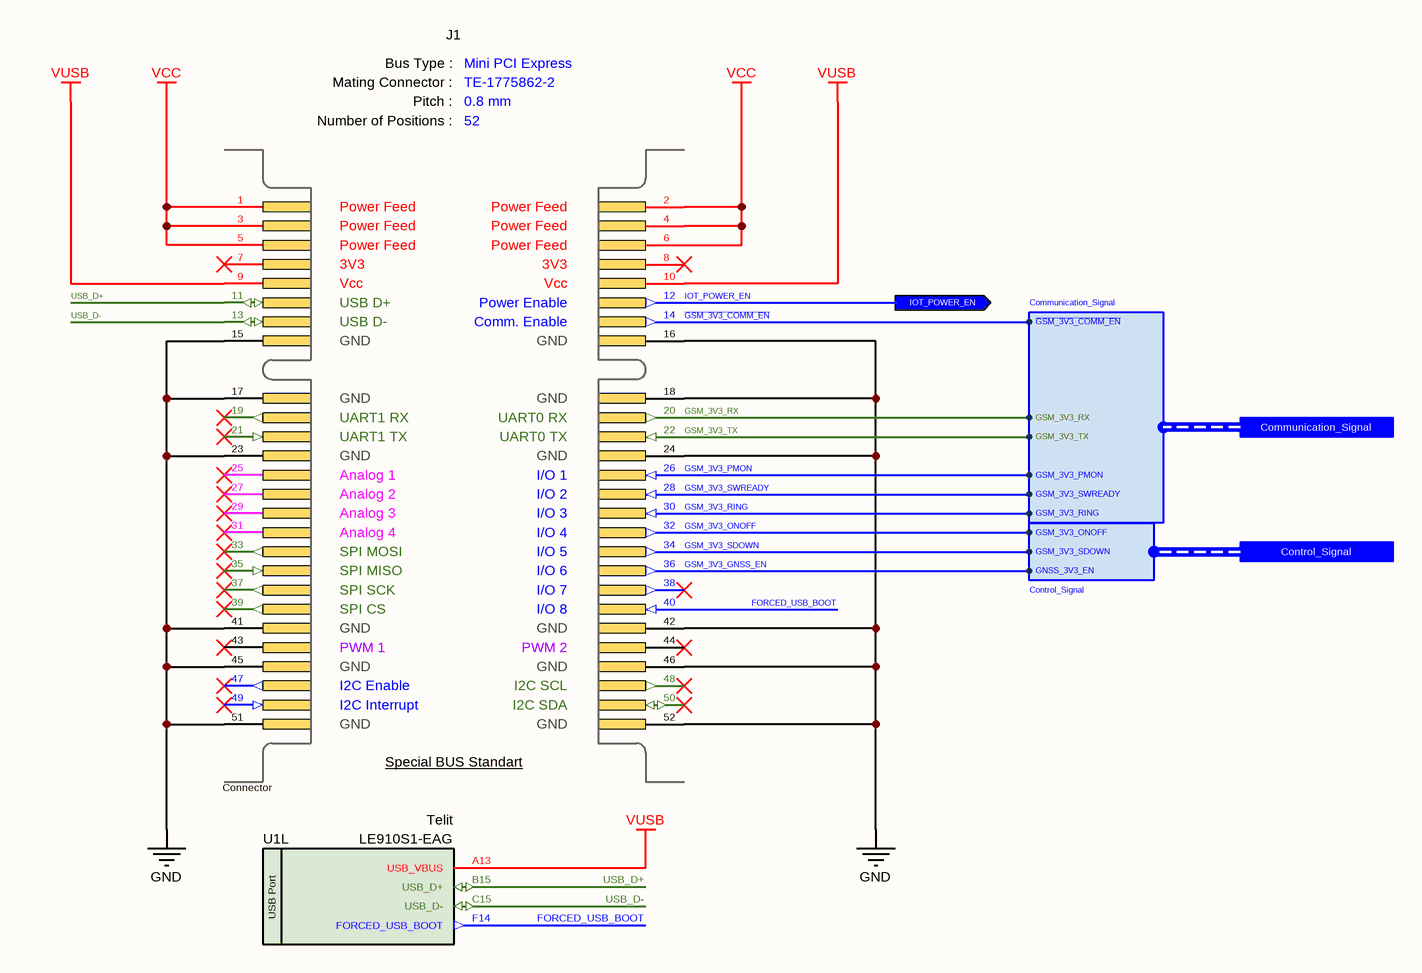
[diagram p8: Card Edge Connector.SchDoc]

### Parts
J1  BUS Type: Mini PCI Express  Mating Connector: TE-1775862-2  Pitch: 0.8 mm  Number of Positions: 52  System: Connector  [PCB - Mini PCI Express]  (hidden comment: Connector - Mini PCI-E [Add-on])  (no BOM)
U1  Manufacturer Part Number: LE910S1-EAG  Manufacturer Name: Telit  [LE910 GSM Modem]  (hidden comment: LE910S1-EAG LTE GSM Module)  (part L of 19)

### Ports
Communication_Signal (harness Communication_Signal), Control_Signal (harness Control_Signal), IOT_POWER_EN (out)

### Harnesses
Communication_Signal: GSM_3V3_PMON, GSM_3V3_SWREADY, GSM_3V3_RING, ~{GSM_3V3_COMM_EN}, GSM_3V3_TX, GSM_3V3_RX
Control_Signal: GSM_3V3_ONOFF, GSM_3V3_SDOWN, GNSS_3V3_EN

### Nets
GND: J1.15(Pin-15) J1.16(Pin-16) J1.17(Pin-17) J1.18(Pin-18) J1.23(Pin-23) J1.24(Pin-24) J1.41(Pin-41) J1.42(Pin-42) J1.45(Pin-45) J1.46(Pin-46) J1.51(Pin-51) J1.52(Pin-52)
VCC: J1.1(Pin-1) J1.2(Pin-2) J1.3(Pin-3) J1.4(Pin-4) J1.5(Pin-5) J1.6(Pin-6)
VUSB: J1.9(Pin-9) J1.10(Pin-10) U1.A13(USB_VBUS)
FORCED_USB_BOOT: J1.40(Pin-40) U1.F14(FORCED_USB_BOOT)
~{GSM_3V3_COMM_EN}: J1.14(Pin-14) ; port Communication_Signal.~{GSM_3V3_COMM_EN}
GSM_3V3_GNSS_EN: J1.36(Pin-36) ; port Control_Signal.GNSS_3V3_EN  [project net GNSS_3V3_EN]
GSM_3V3_ONOFF: J1.32(Pin-32) ; port Control_Signal.GSM_3V3_ONOFF
GSM_3V3_PMON: J1.26(Pin-26) ; port Communication_Signal.GSM_3V3_PMON
GSM_3V3_RING: J1.30(Pin-30) ; port Communication_Signal.GSM_3V3_RING
GSM_3V3_RX: J1.20(Pin-20) ; port Communication_Signal.GSM_3V3_RX  [project net GNSS_3V3_RX]
GSM_3V3_SDOWN: J1.34(Pin-34) ; port Control_Signal.GSM_3V3_SDOWN
GSM_3V3_SWREADY: J1.28(Pin-28) ; port Communication_Signal.GSM_3V3_SWREADY
GSM_3V3_TX: J1.22(Pin-22) ; port Communication_Signal.GSM_3V3_TX
IOT_POWER_EN: J1.12(Pin-12) ; port IOT_POWER_EN
USB_D+: J1.11(Pin-11) U1.B15(USB_D+)
USB_D-: J1.13(Pin-13) U1.C15(USB_D-)

Not connected (* = marked no-connect by the designer): J1 7(Pin-7)* 8(Pin-8)* 19(Pin-19)* 21(Pin-21)* 25(Pin-25)* 27(Pin-27)* 29(Pin-29)* 31(Pin-31)* 33(Pin-33)* 35(Pin-35)* 37(Pin-37)* 38(Pin-38)* 39(Pin-39)* 43(Pin-43)* 44(Pin-44)* 47(Pin-47)* 48(Pin-48)* 49(Pin-49)* 50(Pin-50)*

### Notes on the sheet
- © 2021 All rights reserved.
  This document may not, in whole or in part, be copied, photocopied, reproduced, translated or converted to any electronic or machine readable from without prior written permission of Mehmet Günce Akkoyun.
  Engineer contact : akkoyun@me.com
- Property of
- Engineer :
- Date :
- Size :
- A4
- Time :
- Project :
- Page :
- /
- Customer :
- Product ID :
- Module ID :
- Version :
- File :
- Revision :
- (in symbol Connector - Mini PCI-E [Add-on]) Bus Type :; Mating Connector :; Pitch :; Number of Positions :; Power Feed; 3V3; Vcc; USB D+; Power Enable; USB D-; Comm. Enable; GND; UART1 RX; UART0 RX; UART1 TX; UART0 TX; Analog 1; I/O 1; Analog 2; I/O 2; Analog 3; I/O 3; Analog 4; I/O 4; SPI MOSI; I/O 5; SPI MISO; I/O 6; SPI SCK; I/O 7; SPI CS; I/O 8; PWM 1; PWM 2; I2C Enable; I2C SCL; I2C Interrupt; I2C SDA; Special BUS Standart
- (in symbol IC - LE910S1-EAG, part L) USB Port

### Library data of the parts
J1 = Connector - Mini PCI-E [Add-on]: Mini PCI-Express gold finger connector.
U1 = IC - LE910S1-EAG: Telit LE910S1-EAG GPRS/GNSS Module; Case: BGA

## Sheet GNSS PPS LED Driver.SchDoc: GNSS PPS LED Driver
size 292 x 193 mm; SheetNumber: 11; SheetTotal: 15
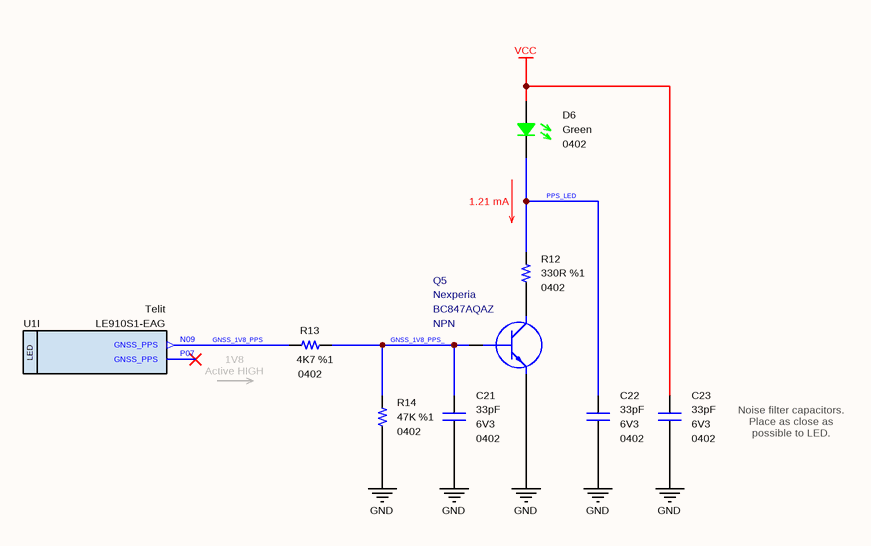
[diagram p9: GNSS PPS LED Driver.SchDoc]

### Parts
C21  value 33pF  Case: 0402  Voltage: 6V3  [CAPACITOR_0402]
C22  value 33pF  Case: 0402  Voltage: 6V3  [CAPACITOR_0402]
C23  value 33pF  Case: 0402  Voltage: 6V3  [CAPACITOR_0402]
D6  Case: 0402  Color: Green  [LED_0402]
Q5  Polarity: NPN  Manufacturer Part Number: BC847AQAZ  Manufacturer Name: Nexperia  [SOT1215]
R12  value 330R  Case: 0402  Tolerance: %1  [RESISTOR_0402]
R13  value 4K7  Case: 0402  Tolerance: %1  [RESISTOR_0402]
R14  value 47K  Case: 0402  Tolerance: %1  [RESISTOR_0402]
U1  Manufacturer Part Number: LE910S1-EAG  Manufacturer Name: Telit  [LE910 GSM Modem]  (hidden comment: LE910S1-EAG LTE GSM Module)  (part I of 19)

### Nets
GND: C21.1 C22.1 C23.1 Q5.2(E) R14.1
VCC: C23.2 D6.2
GNSS_1V8_PPS: R13.2 U1.N09(GNSS_PPS)
GNSS_1V8_PPS_: C21.2 Q5.1(B) R13.1 R14.2
PPS_LED: C22.2 D6.1 R12.2
NetQ5_3: Q5.3(C) R12.1

Not connected (* = marked no-connect by the designer): U1 P07(GNSS_PPS)*

### Notes on the sheet
- 1.21 mA
- 1V8
  Active HIGH
- Noise filter capacitors. Place as close as possible to LED.
- © 2021 All rights reserved.
  This document may not, in whole or in part, be copied, photocopied, reproduced, translated or converted to any electronic or machine readable from without prior written permission of Mehmet Günce Akkoyun.
  Engineer contact : akkoyun@me.com
- Property of
- Engineer :
- Date :
- Size :
- A4
- Time :
- Project :
- Page :
- /
- Customer :
- Product ID :
- Module ID :
- Version :
- File :
- Revision :
- (in symbol IC - LE910S1-EAG, part I) LED

### Library data of the parts
C21-C23 = 33pF [0402-6V3]: as C8 on sheet GSM Stat LED Driver; Height: 0.5mm; Maximum Operating Temperature: +125; Minimum Operating Temperature: -55; ROHS: Yes; ComponentLink1Description: DataSheet; ComponentLink1URL: https://api.kemet.com/component-edge/download/datasheet/C0402C330J9RACAUTO.pdf; ComponentLink2Description: Mouser; ComponentLink2URL: https://www.mouser.com/Search/Refine.aspx?Keyword=80-C0402C330J9RAUTO
D6 = LED (0402-Green): as D5 on sheet GSM Stat LED Driver; ROHS: Yes; ComponentLink1Description: DataSheet; ComponentLink1URL: https://www.mouser.com.tr/datasheet/2/348/sml-p1-e-1139198.pdf; ComponentLink2Description: Mouser; ComponentLink2URL: https://www.mouser.com.tr/ProductDetail/ROHM-Semiconductor/SML-P12U2TT86R?qs=sGAEpiMZZMseGfSY3csMkRIBDsfU3UCXJTULB5gem9Ta%252Bp%252BvZ709fg%3D%3D
Q5 = BC847: Bipolar NPN Transistors; Case: DFN-1010D-3
R12 = 330R: as R5 on sheet GSM Stat LED Driver; Height: 0.4mm; ComponentLink1Description: DataSheet; ComponentLink1URL: https://www.mouser.com.tr/datasheet/2/427/dcrcwe3-1762152.pdf; ComponentLink2Description: Mouser; ComponentLink2URL: https://www.mouser.com.tr/ProductDetail/Vishay-Dale/CRCW0402330RFKED?qs=sGAEpiMZZMu61qfTUdNhG2DpbjADlD3GGS6SwBlLi5Q%3D
R13 = 4K7: as R6 on sheet GSM Stat LED Driver; Height: 0.4mm; ComponentLink1Description: DataSheet; ComponentLink1URL: https://www.mouser.com.tr/datasheet/2/427/dcrcwe3-1762152.pdf; ComponentLink2Description: Mouser; ComponentLink2URL: https://www.mouser.com.tr/ProductDetail/Vishay-Dale/CRCW04024K70FKED?qs=sGAEpiMZZMu61qfTUdNhG7nHf%2F6MTUn3HadIdDQu24Q%3D
R14 = 47K: as R7 on sheet GSM Stat LED Driver; ComponentLink1URL: https://www.mouser.com.tr/datasheet/2/427/dcrcwe3-1762152.pdf; ComponentLink1Description: DataSheet; Height: 0.4mm; ComponentLink2Description: Mouser; ComponentLink2URL: https://www.mouser.com.tr/ProductDetail/Vishay-Dale/CRCW040247K0FKED?qs=sGAEpiMZZMu61qfTUdNhG2DpbjADlD3GL%252B3h1elTxqU%3D
U1 = IC - LE910S1-EAG: Telit LE910S1-EAG GPRS/GNSS Module; Case: BGA

## Sheet GSM Modem Power Feed.SchDoc: GSM Modem Power Feed
size 292 x 193 mm; SheetNumber: 3; SheetTotal: 14
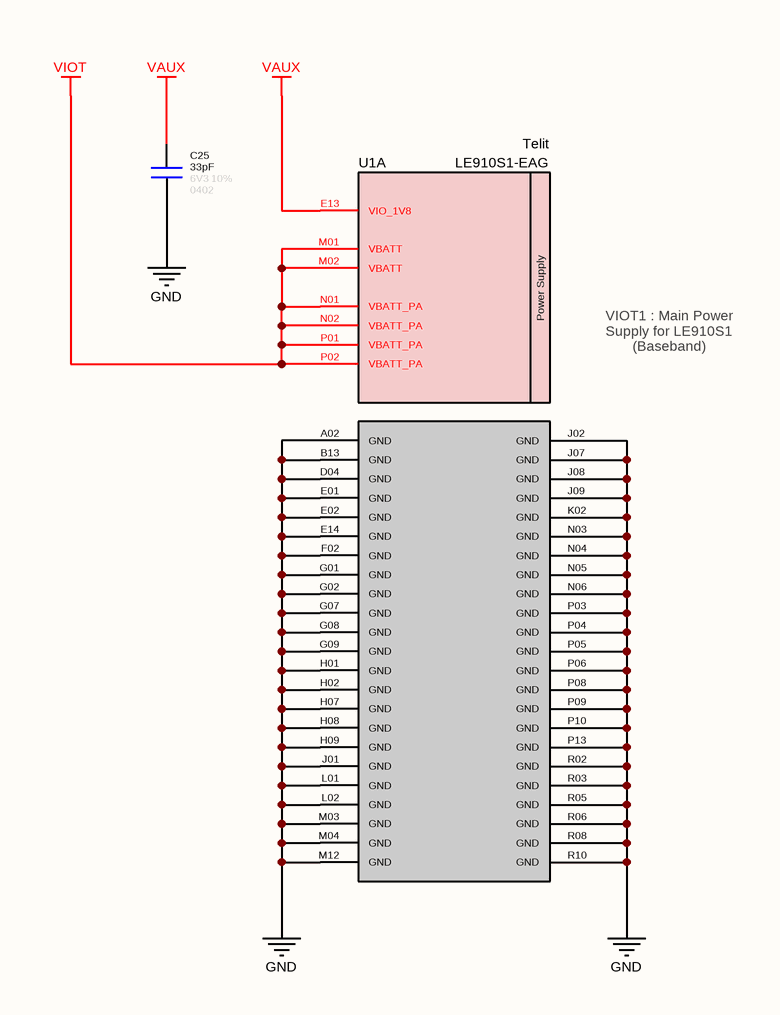
[diagram p10: GSM Modem Power Feed.SchDoc]

### Parts
C25  value 33pF  Tolerance: 10%  Case: 0402  Voltage: 6V3  [CAPACITOR_0402]  (hidden comment: Capacitor - 33pF [0402] (Ceramic))
U1  Manufacturer Part Number: LE910S1-EAG  Manufacturer Name: Telit  [LE910 GSM Modem]  (hidden comment: LE910S1-EAG LTE GSM Module)  (part A of 19)

### Nets
GND: C25.1 U1.A02(GND) U1.B13(GND) U1.D04(GND) U1.E01(GND) U1.E02(GND) U1.E14(GND) U1.F02(GND) U1.G01(GND) U1.G02(GND) U1.G07(GND) U1.G08(GND) U1.G09(GND) U1.H01(GND) U1.H02(GND) U1.H07(GND) U1.H08(GND) U1.H09(GND) U1.J01(GND) U1.J02(GND) U1.J07(GND) U1.J08(GND) U1.J09(GND) U1.K02(GND) U1.L01(GND) U1.L02(GND) U1.M03(GND) U1.M04(GND) U1.M12(GND) U1.N03(GND) U1.N04(GND) U1.N05(GND) U1.N06(GND) U1.P03(GND) U1.P04(GND) U1.P05(GND) U1.P06(GND) U1.P08(GND) U1.P09(GND) U1.P10(GND) U1.P13(GND) U1.R02(GND) U1.R03(GND) U1.R05(GND) U1.R06(GND) U1.R08(GND) U1.R10(GND)
VAUX: C25.2 U1.E13(VIO_1V8)
VIOT: U1.M01(VBATT) U1.M02(VBATT) U1.N01(VBATT_PA) U1.N02(VBATT_PA) U1.P01(VBATT_PA) U1.P02(VBATT_PA)

### Notes on the sheet
- (near U1) VIOT1 : Main Power Supply for LE910S1 (Baseband)
- © 2021 All rights reserved.
  This document may not, in whole or in part, be copied, photocopied, reproduced, translated or converted to any electronic or machine readable from without prior written permission of Mehmet Günce Akkoyun.
  Engineer contact : akkoyun@me.com
- Property of
- Engineer :
- Date :
- Size :
- A4
- Time :
- Project :
- Page :
- /
- Customer :
- Product ID :
- Module ID :
- Version :
- File :
- Revision :
- (in symbol IC - LE910S1-EAG, part A) Power Supply

### Library data of the parts
C25 = Capacitor - 33pF [0402-6V3]: as C26 on sheet Voltage Translator; ComponentLink1Description: DataSheet; ComponentLink1URL: https://api.kemet.com/component-edge/download/datasheet/C0402C330J9RACAUTO.pdf; ComponentLink2Description: Mouser; ComponentLink2URL: https://www.mouser.com/Search/Refine.aspx?Keyword=80-C0402C330J9RAUTO
U1 = IC - LE910S1-EAG: Telit LE910S1-EAG GPRS/GNSS Module; Case: BGA

## Sheet Signal Control Block.SchDoc: Signal Control Block
size 292 x 193 mm; SheetNumber: 5; SheetTotal: 15
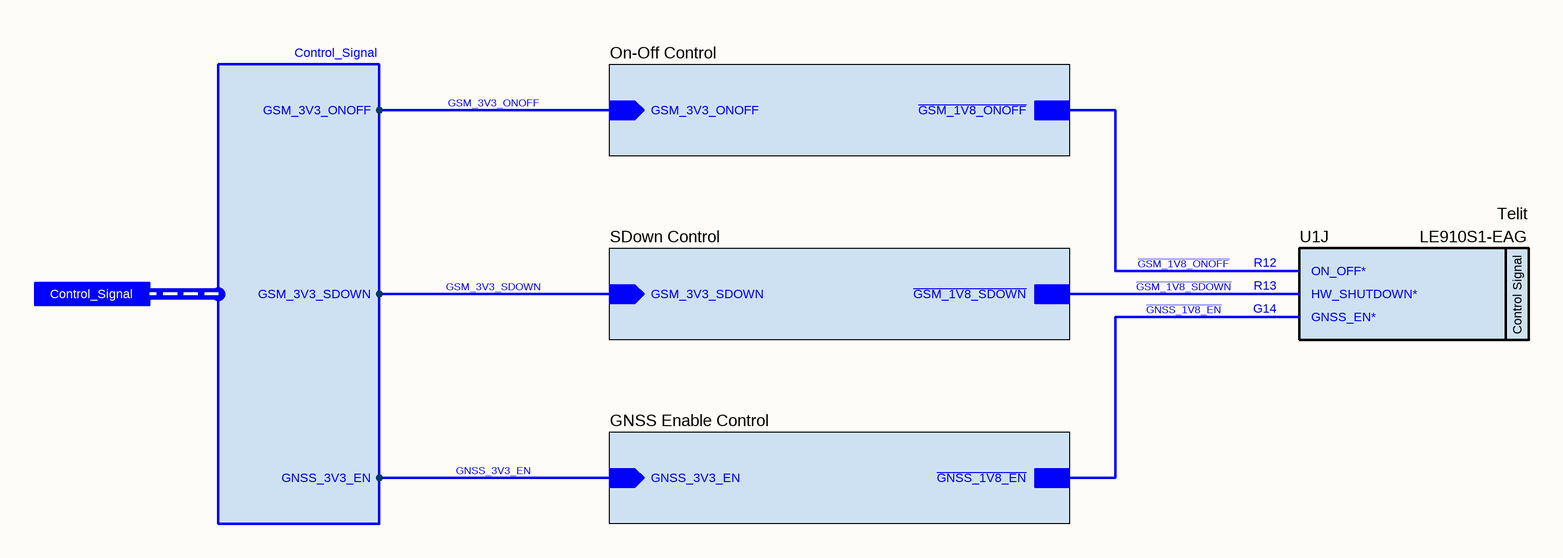
[diagram p11: Signal Control Block.SchDoc]

### Parts
U1  Manufacturer Part Number: LE910S1-EAG  Manufacturer Name: Telit  [LE910 GSM Modem]  (hidden comment: LE910S1-EAG LTE GSM Module)  (part J of 19)

### Sub-sheets
GNSS Enable Control = GNSS EN Signal Control.SchDoc: GNSS_3V3_EN (in), ~{GNSS_1V8_EN}
On-Off Control = On-Off Signal Control.SchDoc: GSM_3V3_ONOFF (in), ~{GSM_1V8_ONOFF}
SDown Control = Shut Down Signal Control.SchDoc: GSM_3V3_SDOWN (in), ~{GSM_1V8_SDOWN}

### Ports
Control_Signal (harness Control_Signal)

### Harnesses
Control_Signal: GSM_3V3_ONOFF, GSM_3V3_SDOWN, GNSS_3V3_EN

### Nets
~{GNSS_1V8_EN}: U1.G14(GNSS_EN*) ; sheet GNSS Enable Control/~{GNSS_1V8_EN}
~{GSM_1V8_ONOFF}: U1.R12(ON_OFF*) ; sheet On-Off Control/~{GSM_1V8_ONOFF}
~{GSM_1V8_SDOWN}: U1.R13(HW_SHUTDOWN*) ; sheet SDown Control/~{GSM_1V8_SDOWN}
GNSS_3V3_EN: sheet GNSS Enable Control/GNSS_3V3_EN, port Control_Signal.GNSS_3V3_EN
GSM_3V3_ONOFF: sheet On-Off Control/GSM_3V3_ONOFF, port Control_Signal.GSM_3V3_ONOFF
GSM_3V3_SDOWN: sheet SDown Control/GSM_3V3_SDOWN, port Control_Signal.GSM_3V3_SDOWN

### Notes on the sheet
- © 2021 All rights reserved.
  This document may not, in whole or in part, be copied, photocopied, reproduced, translated or converted to any electronic or machine readable from without prior written permission of Mehmet Günce Akkoyun.
  Engineer contact : akkoyun@me.com
- Property of
- Engineer :
- Date :
- Size :
- A4
- Time :
- Project :
- Page :
- /
- Customer :
- Product ID :
- Module ID :
- Version :
- File :
- Revision :
- (in symbol IC - LE910S1-EAG, part J) Control Signal

### Library data of the parts
U1 = IC - LE910S1-EAG: Telit LE910S1-EAG GPRS/GNSS Module; Case: BGA

## Sheet On-Off Signal Control.SchDoc: On / Off Signal Control
size 292 x 193 mm; SheetNumber: 6; SheetTotal: 15
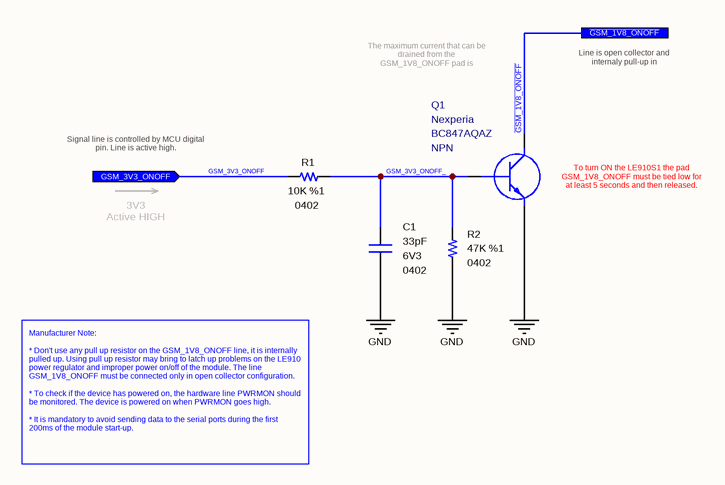
[diagram p12: On-Off Signal Control.SchDoc]

### Parts
C1  value 33pF  Case: 0402  Voltage: 6V3  [CAPACITOR_0402]
Q1  Polarity: NPN  Manufacturer Part Number: BC847AQAZ  Manufacturer Name: Nexperia  [SOT1215]
R1  value 10K  Case: 0402  Tolerance: %1  [RESISTOR_0402]
R2  value 47K  Case: 0402  Tolerance: %1  [RESISTOR_0402]

### Ports
GSM_3V3_ONOFF (in), ~{GSM_1V8_ONOFF}

### Nets
GND: C1.1 Q1.2(E) R2.1
~{GSM_1V8_ONOFF}: Q1.3(C) ; port ~{GSM_1V8_ONOFF}
GSM_3V3_ONOFF: R1.2 ; port GSM_3V3_ONOFF
GSM_3V3_ONOFF_: C1.2 Q1.1(B) R1.1 R2.2

### Notes on the sheet
- The maximum current that can be drained from the GSM_1V8_ONOFF pad is 0.12mA.
- Line is open collector and internaly pull-up in LE910S1.
- Signal line is controlled by MCU digital pin. Line is active high.
- (near Q1) To turn ON the LE910S1 the pad GSM_1V8_ONOFF must be tied low for at least 5 seconds and then released.
- 3V3
  Active HIGH
- Manufacturer Note:
  * Don't use any pull up resistor on the GSM_1V8_ONOFF line, it is internally pulled up. Using pull up resistor may bring to latch up problems on the LE910 power regulator and improper power on/off of the module. The line GSM_1V8_ONOFF must be connected only in open collector configuration.
  * To check if the device has powered on, the hardware line PWRMON should be monitored. The device is powered on when PWRMON goes high.
  * It is mandatory to avoid sending data to the serial ports during the first 200ms of the module start-up.
- © 2021 All rights reserved.
  This document may not, in whole or in part, be copied, photocopied, reproduced, translated or converted to any electronic or machine readable from without prior written permission of Mehmet Günce Akkoyun.
  Engineer contact : akkoyun@me.com
- Property of
- Engineer :
- Date :
- Size :
- A4
- Time :
- Project :
- Page :
- /
- Customer :
- Product ID :
- Module ID :
- Version :
- File :
- Revision :

### Library data of the parts
C1 = 33pF [0402-6V3]: as C8 on sheet GSM Stat LED Driver; Height: 0.5mm; Maximum Operating Temperature: +125; Minimum Operating Temperature: -55; ROHS: Yes; ComponentLink1Description: DataSheet; ComponentLink1URL: https://api.kemet.com/component-edge/download/datasheet/C0402C330J9RACAUTO.pdf; ComponentLink2Description: Mouser; ComponentLink2URL: https://www.mouser.com/Search/Refine.aspx?Keyword=80-C0402C330J9RAUTO
Q1 = BC847: Bipolar NPN Transistors; Case: DFN-1010D-3
R1 = 10K: as R9 on sheet GNSS Antenna; Height: 0.4mm; ComponentLink1Description: DataSheet; ComponentLink1URL: https://www.mouser.com.tr/datasheet/2/427/dcrcwe3-1762152.pdf; ComponentLink2Description: Mouser; ComponentLink2URL: https://www.mouser.com.tr/ProductDetail/Vishay-Dale/CRCW040210K0FKED?qs=sGAEpiMZZMu61qfTUdNhG2DpbjADlD3GcalbOv9utCY%3D
R2 = 47K: as R7 on sheet GSM Stat LED Driver; ComponentLink1URL: https://www.mouser.com.tr/datasheet/2/427/dcrcwe3-1762152.pdf; ComponentLink1Description: DataSheet; Height: 0.4mm; ComponentLink2Description: Mouser; ComponentLink2URL: https://www.mouser.com.tr/ProductDetail/Vishay-Dale/CRCW040247K0FKED?qs=sGAEpiMZZMu61qfTUdNhG2DpbjADlD3GL%252B3h1elTxqU%3D